# Altium schematic sheet DC Motor Driver.SchDoc
size A
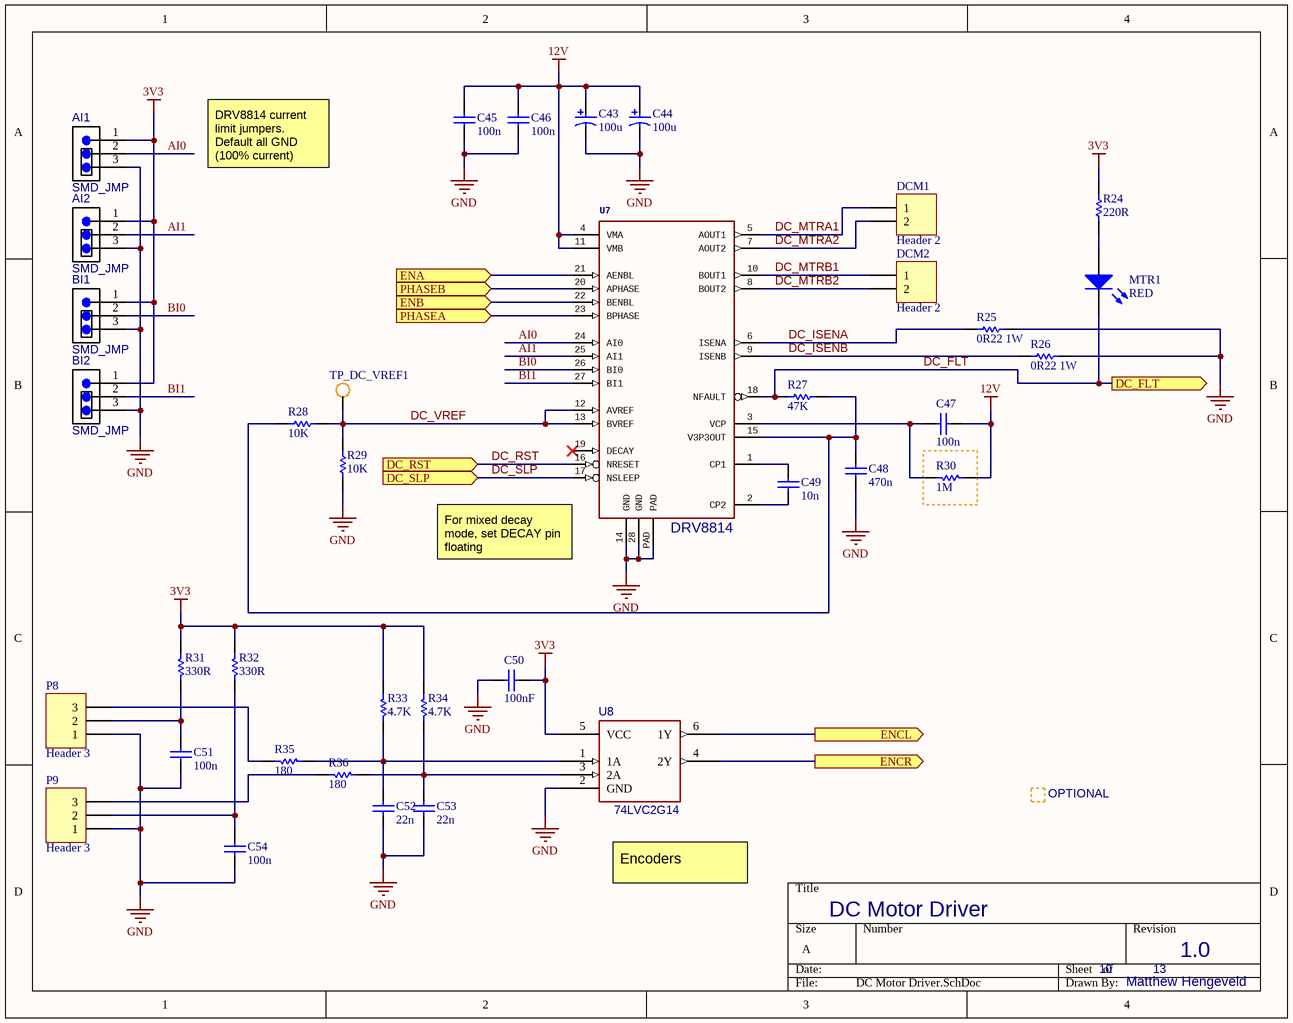
[diagram p0: DC Motor Driver.SchDoc]

## Parts
AI1  SMD_JMP  [0603_JUMPER]
AI2  SMD_JMP  [0603_JUMPER]
BI1  SMD_JMP  [0603_JUMPER]
BI2  SMD_JMP  [0603_JUMPER]
C43  100u  [SMD-CAP-0606]
C44  100u  [SMD-CAP-0606]
C45  100n  [CAPC1608X87X35LL15T15]
C46  100n  [CAPC1608X87X35LL15T15]
C47  100n  [CAPC1608X87X35LL15T15]
C48  470n  [CAPC1608X90X35LL10T15]
C49  10n  [CAPC1608X87X35LL15T15]
C50  100nF  [CAPC1608X92X38LL15T08]
C51  100n  [CAPC1608X87X35LL15T15]
C52  22n  [CAPC1608X87X35LL15T15]
C53  22n  [CAPC1608X87X35LL15T15]
C54  100n  [CAPC1608X87X35LL15T15]
DCM1  Header 2  [HDR1X2]
DCM2  Header 2  [HDR1X2]
MTR1  RED  [0805_A]
P8  Header 3  [HDR1X3]
P9  Header 3  [HDR1X3]
R24  220R  [RESC1608X55X30LL15T15]
R25  0R22 1W  [ROHM-MCR100-2_V]
R26  0R22 1W  [ROHM-MCR100-2_V]
R27  47K  [RESC1608X55X30LL15T15]
R28  10K  [RESC1608X55X30LL15T15]
R29  10K  [RESC1608X55X30LL15T15]
R30  1M  [RESC1608X55X30LL15T15]
R31  330R  [RESC1608X55X30LL15T15]
R32  330R  [RESC1608X55X30LL15T15]
R33  4.7K  [RESC1608X55X30LL15T15]
R34  4.7K  [RESC1608X55X30LL15T15]
R35  180  [RESC1608X55X30LL15T15]
R36  180  [RESC1608X55X30LL15T15]
TP_DC_VREF1  Test point  [SMD Test Hook]  (value not drawn)
U7  DRV8814  [TI-PWP28]  (value not drawn)
U8  74LVC2G14  [ONSC-SOT-363-6-419B-02_V]  (value not drawn)

## Ports
DC_FLT (out), DC_RST (in), DC_SLP (in), ENA (in), ENB (in), ENCL (out), ENCR (out), PHASEA (in), PHASEB (in)

## Nets
3V3: AI1.1 AI2.1 BI1.1 BI2.1 C50.2 R24.1 R31.2 R32.2 R33.1 R34.1 U8.5(VCC)
12V: C43.1 C44.1 C45.2 C46.2 C47.1 R30.1 U7.4(VMA) U7.11(VMB)
GND: AI1.3 AI2.3 BI1.3 BI2.3 C43.2 C44.2 C45.1 C46.1 C48.1 C50.1 C51.2 C52.2 C53.2 C54.2 P8.1 P9.1 R25.2 R26.2 R29.1 U7.14(GND) U7.28(GND) U7.PAD U8.2(GND)
AI0: AI1.2 U7.24(AI0)
AI1: AI2.2 U7.25(AI1)
BI0: BI1.2 U7.26(BI0)
BI1: BI2.2 U7.27(BI1)
DC_FLT: MTR1.1(K) R27.2 U7.18(NFAULT) ; port DC_FLT
DC_ISENA: R25.1 U7.6(ISENA)
DC_ISENB: R26.1 U7.9(ISENB)
DC_MTRA1: DCM1.1 U7.5(AOUT1)
DC_MTRA2: DCM1.2 U7.7(AOUT2)
DC_MTRB1: DCM2.1 U7.10(BOUT1)
DC_MTRB2: DCM2.2 U7.8(BOUT2)
DC_RST: U7.16(NRESET) ; port DC_RST
DC_SLP: U7.17(NSLEEP) ; port DC_SLP
DC_VREF: R28.1 R29.2 TP_DC_VREF1.1(point) U7.12(AVREF) U7.13(BVREF)
ENA: U7.21(AENBL) ; port ENA
ENB: U7.22(BENBL) ; port ENB
ENCL: U8.6(1Y) ; port ENCL
ENCR: U8.4(2Y) ; port ENCR
PHASEA: U7.23(BPHASE) ; port PHASEA
PHASEB: U7.20(APHASE) ; port PHASEB
NetC47_2: C47.2 R30.2 U7.3(VCP)
NetC48_2: C48.2 R27.1 R28.2 U7.15(V3P3OUT)
NetC49_1: C49.1 U7.2(CP2)
NetC49_2: C49.2 U7.1(CP1)
NetC51_1: C51.1 P8.2 R31.1
NetC52_1: C52.1 R33.2 R35.1 U8.1(1A)
NetC53_1: C53.1 R34.2 R36.1 U8.3(2A)
NetC54_1: C54.1 P9.2 R32.1
NetMTR1_2: MTR1.2(A) R24.2
NetP8_3: P8.3 R35.2
NetP9_3: P9.3 R36.2

Not connected (* = marked no-connect by the designer): U7 19(DECAY)*

## Notes on the sheet
- DRV8814 current limit jumpers. Default all GND (100% current)
- (near U7) For mixed decay mode, set DECAY pin floating
- (near U7) DRV8814
- OPTIONAL
- Encoders
- DC Motor Driver
- 10
- 13
- 1.0
- Matthew Hengeveld

## Library data of the parts
C43 C44 = CAP-EL-0606-SMD: Aluminum Electrolytic Capacitor, UD Series, Low Impedance, 100 uF, 35 V, + / - 20%, -55 to 105 degC, Chip Type, 8 x 10 mm D x L, Pb-Free, Reel; PartNumber: UUD1V101MNL1GS; Manufacturer: Nichicon; Rated Ripple Current (at 100kHz): 450 mA; Packing: Dia382mm Reel; Endurance Time: 5000 h; Impedance: 0.17 Ohm; Rated Voltage: 35 V; Rated Capacitance: 100 uF; Tolerance Rated Capacitance: -20 to 20%; ComponentLink2URL: http://products.nichicon.co.jp/en/pdf/XJA043/e-ud.pdf; DatasheetVersion: 08/2012; ComponentLink1Description: Manufacturer URL; Diameter: 8 mm; RoHS: TRUE; ComponentLink3Description: Package Specification; Mounting Technology: Surface Mount; ComponentLink3URL: http://products.nichicon.co.jp/en/pdf/XJA043/e-ud.pdf; Length: 10 mm; PackageReference: CAPAE-D8H10; ComponentLink1URL: http://www.nichicon.co.jp/; ComponentLink2Description: Datasheet; PackageDescription: 2-Pin Surface Mount Device, Diameter 8 mm, Height 10 mm, Pitch 6.5 mm
C45-C47 C51-C54 = CMP-2006-03300-1: Part Number: C0603X104K5RACTU; Manufacturer: Kemet
C48 = CMP-2006-02860-1: Manufacturer: Murata; Part Number: GRM188R71C474KA88D
C49 = CMP-2006-03036-1: Manufacturer: Kemet; Part Number: C0603C103K1RACTU
C50 = CMP-2006-01974-1: Part Number: VJ0603Y104KNXAO; Manufacturer: Vitramon
DCM1 DCM2 = Header 2: Header, 2-Pin; LatestRevisionDate: 17-Jul-2002; LatestRevisionNote: Re-released for DXP Platform.; Publisher: Altium Limited
MTR1 = CMP-1426-00011-1: SMD mono-color Chip LED, WL-SMCW, Red; PartNumber: 150080RS75000; Manufacturer: Wuerth Elektronik; Color: Red; PackageReference: 0805_A; ComponentLink2Description: Datasheet; ComponentLink1URL: http://www.we-online.com; ComponentLink1Description: Manufacturer URL; ComponentLink2URL: http://katalog.we-online.com/led/datasheet/150080RS75000.pdf
P8 P9 = Header 3: Header, 3-Pin; LatestRevisionDate: 17-Jul-2002; LatestRevisionNote: Re-released for DXP Platform.; Publisher: Altium Limited
R24 R27-R36 = CMP-2000-00704-1: Manufacturer: Panasonic; Part Number: ERJ-3GEYJ103V
R25 R26 = CMP-1238-00003-1: Low Ohmic Thick Film Chip Resistor, 0.47 Ohm, -55 to 125 degC, 2-Pin SMD, RoHS, Tape; PartNumber: MCR100JZHFLR470; Manufacturer: ROHM Semiconductor; Overload Voltage: 6.02 V Max.; Limiting Element Voltage: 3.01 V; Resistance Tolerance: +/-1%; PackageDescription: 2-Pin Chip Resistor, Body 6.3 x 3.2 mm, Height 0.7 mm; Rated Power@70 degC: 1 W; ComponentLink3Description: Package Specification; ComponentLink2Description: Datasheet; Resistance: 0.47 Ohm; Packing: Tape; DatasheetVersion: Rev. C; ComponentLink2URL: http://rohmfs.rohm.com/en/products/databook/datasheet/passive/resistor/chip_resistor/mcr_low.pdf; Operating Temperature: -55 to 125 degC; ComponentLink3URL: http://rohmfs.rohm.com/en/products/databook/datasheet/passive/resistor/chip_resistor/mcr_low.pdf; ComponentLink1URL: http://www.rohm.com/web/global/; Mounting Technology: Surface Mount; RoHS: TRUE; ComponentLink1Description: Manufacturer URL
U7 = DRV8814: GateName_1: G$1; SymbolName_1: DRV8814; LibraryName: DRV88xx; DeviceSetName: DRV8814; Package: HTSSOP28PWP